# EAGLE schematic untitled (EAGLE 6.4)
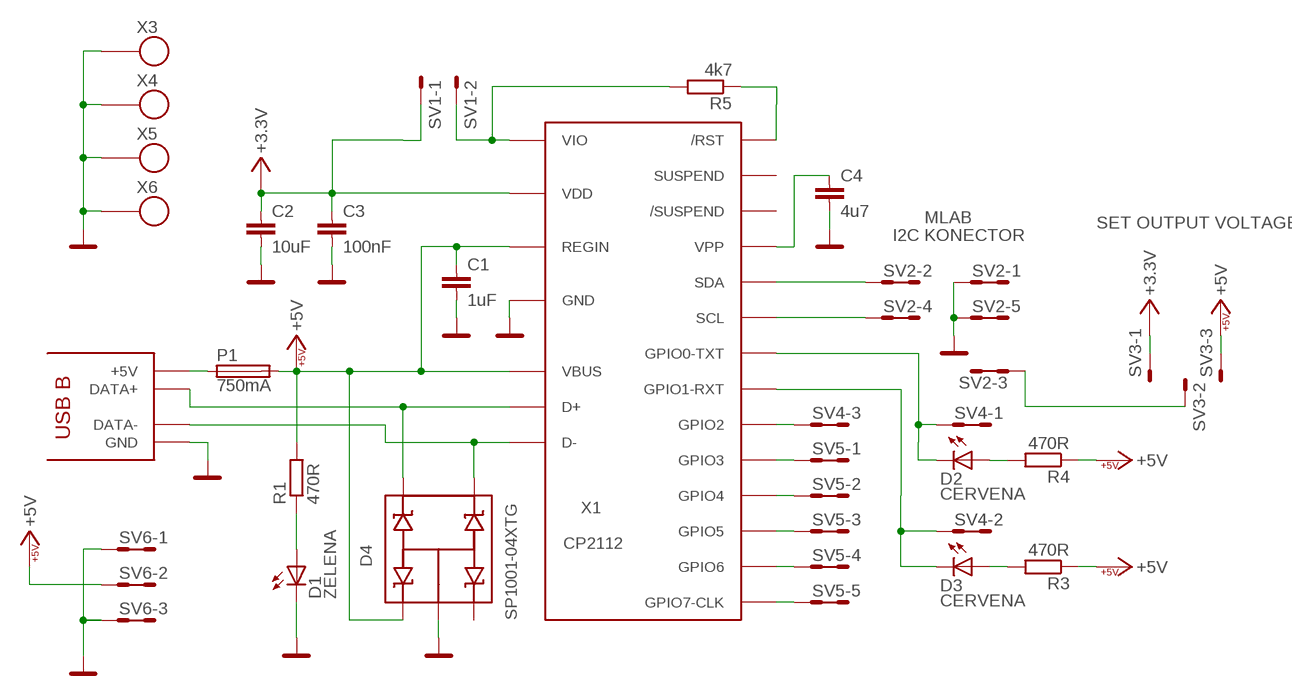
[diagram p0: schematic, sheet 1]

## Parts
C1  1uF  C0805  [C0805]
C2  10uF  C0805  [C0805]
C3  100nF  C0805  [C0805]
C4  4u7  C0805  [C0805]
D1  ZELENA  LED1206_2  [1206_2]
D2  CERVENA  LED1206_2  [1206_2]
D3  CERVENA  LED1206_2  [1206_2]
D4  SP1001-04XTG  CP2112  [SOT553]
P1  750mA  POJISTKA_1812  [1812]
R1  470R  R0805  [0805]
R3  470R  R0805  [0805]
R4  470R  R0805  [0805]
R5  4k7  R0805  [0805]
SV1  MA02-1  [MA02-1]
SV2  MA05-2  [MA05-2]
SV3  MA03-1  [MA03-1]
SV4  MA03-2  [MA03-2]
SV5  MA05-2  [MA05-2]
SV6  MA03-2  [MA03-2]
X1  CP2112  [QFN-24]
X2  USB_B  [USB_B]
X3  SROUB3M  [SROUB3M]
X4  SROUB3M  [SROUB3M]
X5  SROUB3M  [SROUB3M]
X6  SROUB3M  [SROUB3M]

## Nets
0: D2.K(C) SV4.1 SV4.2 X1.P$23(GPIO0-TXT)
1: D3.K(C) SV4.3 SV4.4 X1.P$22(GPIO1-RXT)
2: SV4.5 SV4.6 X1.P$21(GPIO2)
3: SV5.1 SV5.2 X1.P$20(GPIO3)
4: SV5.3 SV5.4 X1.P$15(GPIO4)
5: SV5.5 SV5.6 X1.P$14(GPIO5)
6: SV5.7 SV5.8 X1.P$13(GPIO6)
7: SV5.9 SV5.10 X1.P$12(GPIO7-CLK)
+3.3V: C2.1 C3.1 SV1.1 SV3.1 X1.P$6(VDD)
+5V: C1.1 D4.1 P1.2 R1.2 R3.1 R4.1 SV3.3 SV6.3 SV6.4 X1.P$7(REGIN) X1.P$8(VBUS)
GND: C1.2 C2.2 C3.2 C4.2 D1.K(C) D4.2 SV2.1 SV2.2 SV2.9 SV2.10 SV6.1 SV6.2 SV6.5 SV6.6 X1.P$2(GND) X1.P$25(GND) X2.4(GND) X2.GND X2.GND2(GND) X3.P$1 X4.P$1 X5.P$1 X6.P$1
N$1: D4.5 X1.P$3(D+) X2.3(DATA+)
N$2: D4.4 X1.P$4(D-) X2.2(DATA-)
N$3: C4.1 X1.P$16(VPP)
N$5: P1.1 X2.1(+5V)
N$6: D1.A R1.1
N$7: R5.2 SV1.2 X1.P$5(VIO)
N$10: D3.A R3.2
N$12: SV2.5 SV2.6 SV3.2
N$13: D2.A R4.2
N$15: R5.1 X1.P$9(/RST)
SCL: SV2.7 SV2.8 X1.P$24(SCL)
SDA: SV2.3 SV2.4 X1.P$1(SDA)
Unconnected: D4.3 X1.P$11(SUSPEND) X1.P$17(/SUSPEND)

## Notes on the sheet
- MLAB
- I2C KONECTOR | SET OUTPUT VOLTAGE

## Library data of the parts
C1-C4 = moje_C:C0805
D1-D3 = moje_diody:LED1206_2
D4 = moje_diody:CP2112: SP1001-04XTG
P1 = moje:POJISTKA_1812: Pojistka s pouzdrem 1812
R1 R3-R5 = moje_R:R0805
SV1 = moje_hrebinky:MA02-1
SV2 SV5 = moje_hrebinky:MA05-2: PIN HEADER; OC_FARNELL: unknown; OC_NEWARK: unknown
SV3 = moje_hrebinky:MA03-1: PIN HEADER; OC_FARNELL: unknown; OC_NEWARK: unknown
SV4 SV6 = moje_hrebinky:MA03-2: PIN HEADER; OC_FARNELL: unknown; OC_NEWARK: unknown
X1 = moje_io:CP2112
X2 = moje_konektory:USB_B
X3-X6 = moje:SROUB3M